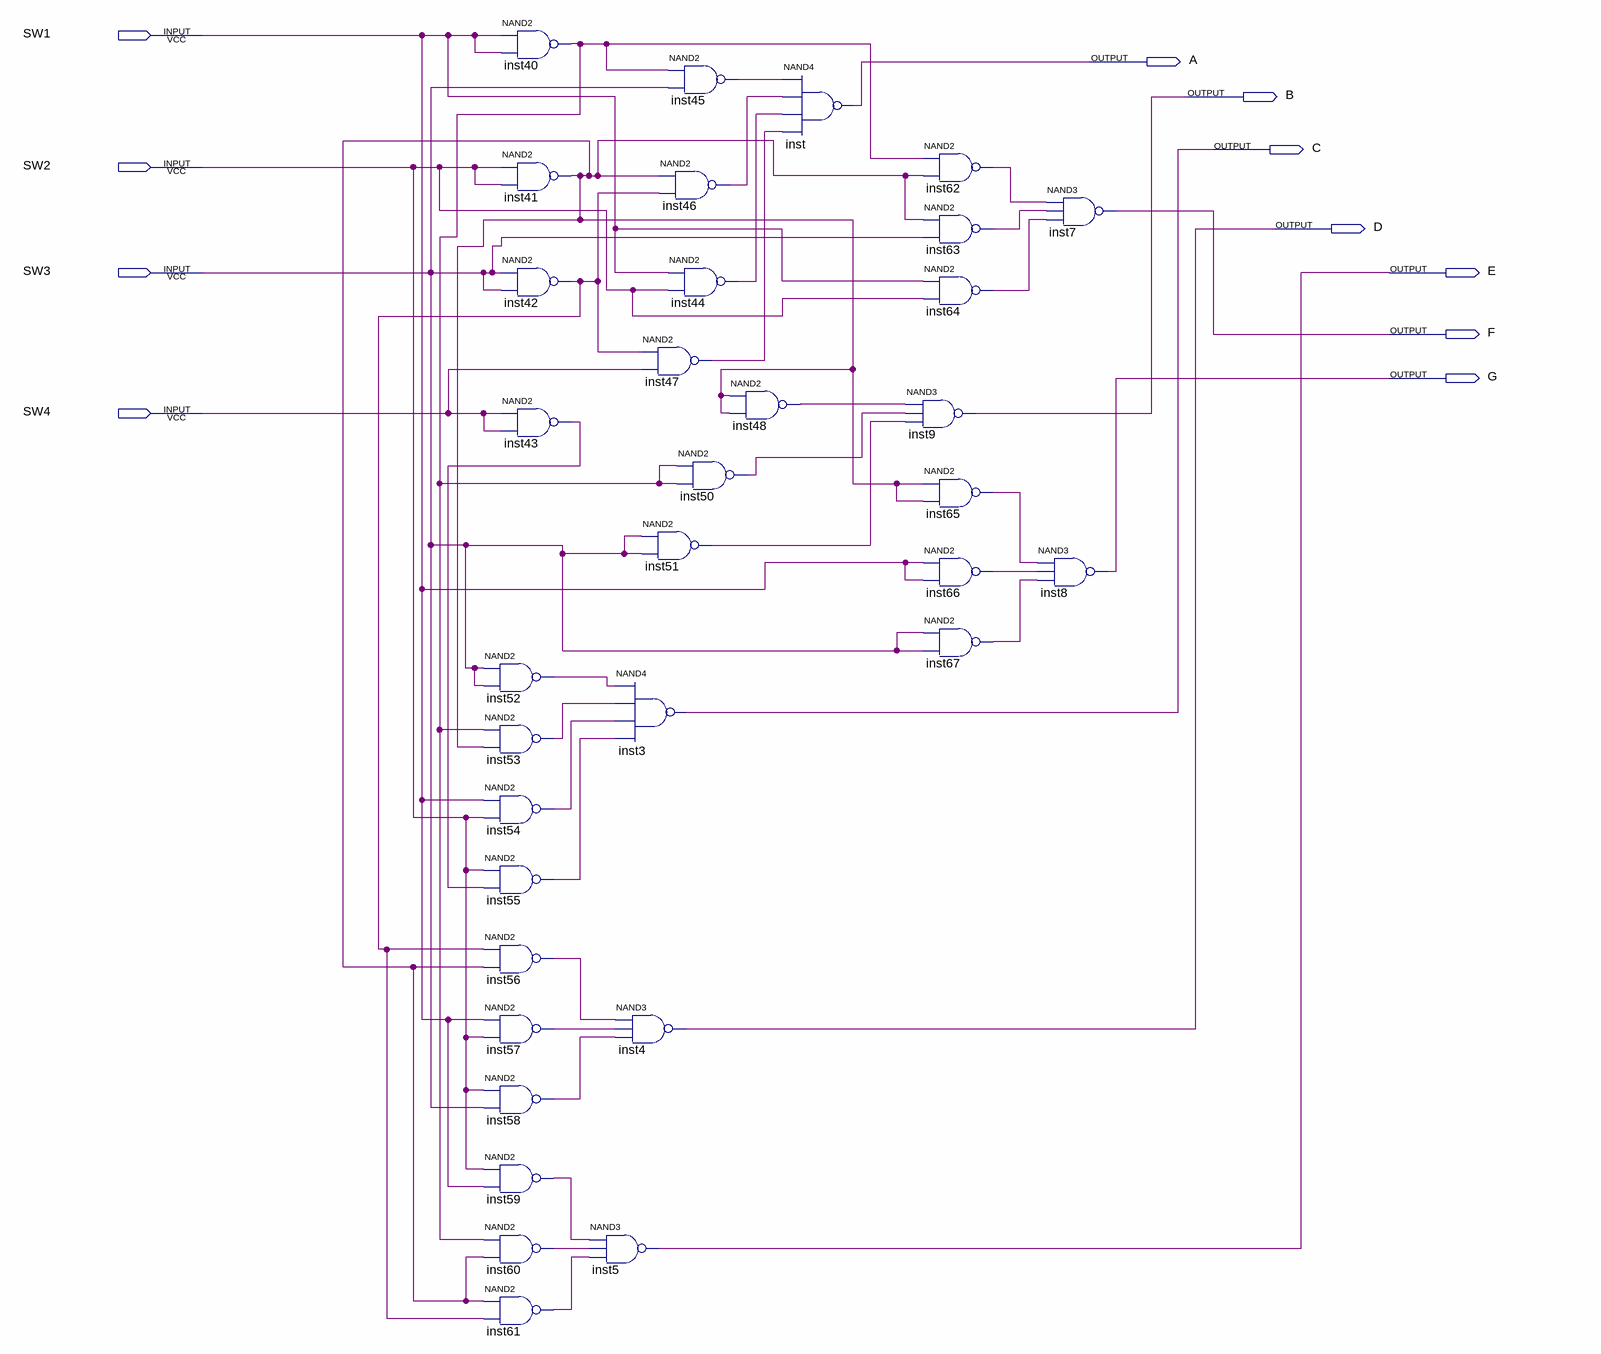
[diagram p0: schematic sheet]
// Quartus schematic cont_nda2_3.bdf as structural Verilog: 34 symbols, 11 pins
module cont_nda2_3 (
  input  SW1,
  input  SW2,
  input  SW3,
  input  SW4,
  output A,
  output B,
  output C,
  output D,
  output E,
  output F,
  output G
);

  wire inst40_out, inst41_out, inst42_out, inst43_out, inst44_out, inst45_out, inst46_out, inst47_out,
       inst48_out, inst50_out, inst51_out, inst52_out, inst53_out, inst54_out, inst55_out, inst56_out,
       inst57_out, inst58_out, inst59_out, inst60_out, inst61_out, inst62_out, inst63_out, inst64_out,
       inst65_out, inst66_out, inst67_out;

  nand inst40 (inst40_out, SW1, SW1);
  nand inst41 (inst41_out, SW2, SW2);
  nand inst42 (inst42_out, SW3, SW3);
  nand inst43 (inst43_out, SW4, SW4);
  nand inst52 (inst52_out, SW3, SW3);
  nand inst53 (inst53_out, inst40_out, inst41_out);
  nand inst54 (inst54_out, SW1, SW2);
  nand inst55 (inst55_out, SW2, inst43_out);
  nand inst56 (inst56_out, inst42_out, inst41_out);
  nand inst57 (inst57_out, SW1, SW2);
  nand inst58 (inst58_out, SW2, SW3);
  nand inst59 (inst59_out, SW2, SW1);
  nand inst60 (inst60_out, inst40_out, inst41_out);
  nand inst61 (inst61_out, inst41_out, inst42_out);
  nand inst47 (inst47_out, inst42_out, SW4);
  nand inst51 (inst51_out, SW3, SW3);
  nand inst3 (C, inst52_out, inst53_out, inst54_out, inst55_out);
  nand inst4 (D, inst56_out, inst57_out, inst58_out);
  nand inst5 (E, inst59_out, inst60_out, inst61_out);
  nand inst45 (inst45_out, inst40_out, SW3);
  nand inst46 (inst46_out, inst41_out, inst42_out);
  nand inst44 (inst44_out, SW1, SW2);
  nand inst50 (inst50_out, inst40_out, inst40_out);
  nand inst (A, inst45_out, inst46_out, inst44_out, inst47_out);
  nand inst48 (inst48_out, inst41_out, inst41_out);
  nand inst62 (inst62_out, inst40_out, inst41_out);
  nand inst63 (inst63_out, inst41_out, SW3);
  nand inst64 (inst64_out, SW1, SW2);
  nand inst9 (B, inst48_out, inst50_out, inst51_out);
  nand inst65 (inst65_out, inst41_out, inst41_out);
  nand inst66 (inst66_out, SW1, SW1);
  nand inst67 (inst67_out, SW3, SW3);
  nand inst7 (F, inst62_out, inst63_out, inst64_out);
  nand inst8 (G, inst65_out, inst66_out, inst67_out);
endmodule
